# EAGLE design Adafruit DotStar Wing (EAGLE 6.4)
COMPANY: ADAFRUIT INDUSTRIES; DRAWN: KTOWN; REV: A
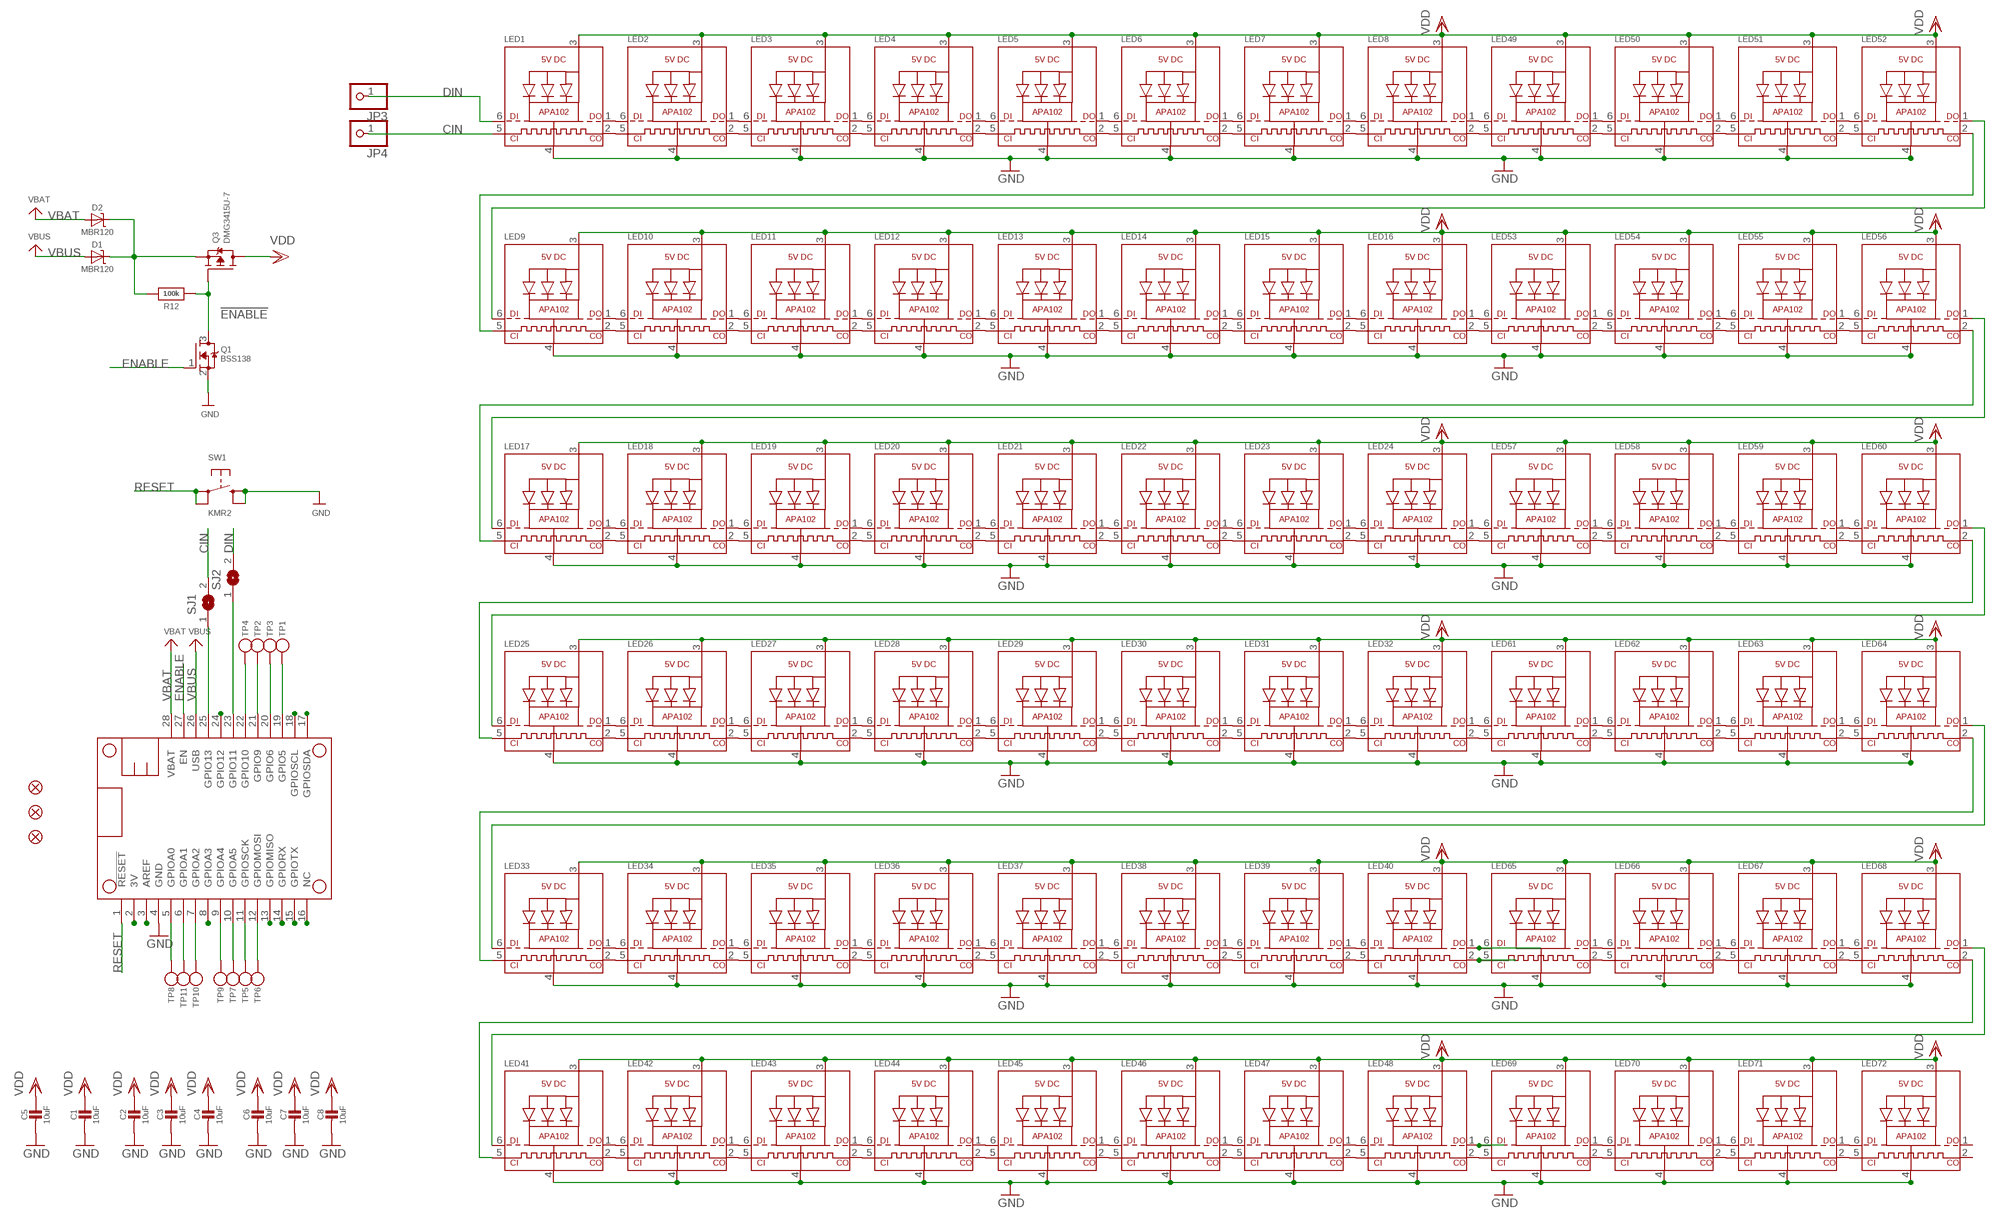
[diagram p0: schematic, sheet 1]

## Parts
C1  10uF  CAP_CERAMIC0805-NOOUTLINE  [0805-NO]
C2  10uF  CAP_CERAMIC0805-NOOUTLINE  [0805-NO]
C3  10uF  CAP_CERAMIC0805-NOOUTLINE  [0805-NO]
C4  10uF  CAP_CERAMIC0805-NOOUTLINE  [0805-NO]
C5  10uF  CAP_CERAMIC0805-NOOUTLINE  [0805-NO]
C6  10uF  CAP_CERAMIC0805-NOOUTLINE  [0805-NO]
C7  10uF  CAP_CERAMIC0805-NOOUTLINE  [0805-NO]
C8  10uF  CAP_CERAMIC0805-NOOUTLINE  [0805-NO]
D1  MBR120  DIODE-SCHOTTKYSOD-123  [SOD-123]
D2  MBR120  DIODE-SCHOTTKYSOD-123  [SOD-123]
FID1  FIDUCIAL_1MM  [FIDUCIAL_1MM]
FID2  FIDUCIAL_1MM  [FIDUCIAL_1MM]
FID3  FIDUCIAL_1MM  [FIDUCIAL_1MM]
JP3  HEADER-1X1ROUND  [1X01_ROUND]
JP4  HEADER-1X1ROUND  [1X01_ROUND]
LED1  APA1022020  [APA102_2020]
LED2  APA1022020  [APA102_2020]
LED3  APA1022020  [APA102_2020]
LED4  APA1022020  [APA102_2020]
LED5  APA1022020  [APA102_2020]
LED6  APA1022020  [APA102_2020]
LED7  APA1022020  [APA102_2020]
LED8  APA1022020  [APA102_2020]
LED9  APA1022020  [APA102_2020]
LED10  APA1022020  [APA102_2020]
LED11  APA1022020  [APA102_2020]
LED12  APA1022020  [APA102_2020]
LED13  APA1022020  [APA102_2020]
LED14  APA1022020  [APA102_2020]
LED15  APA1022020  [APA102_2020]
LED16  APA1022020  [APA102_2020]
LED17  APA1022020  [APA102_2020]
LED18  APA1022020  [APA102_2020]
LED19  APA1022020  [APA102_2020]
LED20  APA1022020  [APA102_2020]
LED21  APA1022020  [APA102_2020]
LED22  APA1022020  [APA102_2020]
LED23  APA1022020  [APA102_2020]
LED24  APA1022020  [APA102_2020]
LED25  APA1022020  [APA102_2020]
LED26  APA1022020  [APA102_2020]
LED27  APA1022020  [APA102_2020]
LED28  APA1022020  [APA102_2020]
LED29  APA1022020  [APA102_2020]
LED30  APA1022020  [APA102_2020]
LED31  APA1022020  [APA102_2020]
LED32  APA1022020  [APA102_2020]
LED33  APA1022020  [APA102_2020]
LED34  APA1022020  [APA102_2020]
LED35  APA1022020  [APA102_2020]
LED36  APA1022020  [APA102_2020]
LED37  APA1022020  [APA102_2020]
LED38  APA1022020  [APA102_2020]
LED39  APA1022020  [APA102_2020]
LED40  APA1022020  [APA102_2020]
LED41  APA1022020  [APA102_2020]
LED42  APA1022020  [APA102_2020]
LED43  APA1022020  [APA102_2020]
LED44  APA1022020  [APA102_2020]
LED45  APA1022020  [APA102_2020]
LED46  APA1022020  [APA102_2020]
LED47  APA1022020  [APA102_2020]
LED48  APA1022020  [APA102_2020]
LED49  APA1022020  [APA102_2020]
LED50  APA1022020  [APA102_2020]
LED51  APA1022020  [APA102_2020]
LED52  APA1022020  [APA102_2020]
LED53  APA1022020  [APA102_2020]
LED54  APA1022020  [APA102_2020]
LED55  APA1022020  [APA102_2020]
LED56  APA1022020  [APA102_2020]
LED57  APA1022020  [APA102_2020]
LED58  APA1022020  [APA102_2020]
LED59  APA1022020  [APA102_2020]
LED60  APA1022020  [APA102_2020]
LED61  APA1022020  [APA102_2020]
LED62  APA1022020  [APA102_2020]
LED63  APA1022020  [APA102_2020]
LED64  APA1022020  [APA102_2020]
LED65  APA1022020  [APA102_2020]
LED66  APA1022020  [APA102_2020]
LED67  APA1022020  [APA102_2020]
LED68  APA1022020  [APA102_2020]
LED69  APA1022020  [APA102_2020]
LED70  APA1022020  [APA102_2020]
LED71  APA1022020  [APA102_2020]
LED72  APA1022020  [APA102_2020]
MS1  FEATHERWING  [FEATHERWING]
Q1  BSS138  MOSFET-NWIDE  [SOT23-WIDE]
Q3  DMG3415U-7  MOSFET-PWIDE  [SOT23-WIDE]
R12  100k  RESISTOR_0603_NOOUT  [0603-NO]
SJ1  SOLDERJUMPERCLOSED  [SOLDERJUMPER_CLOSEDWIRE]
SJ2  SOLDERJUMPERCLOSED  [SOLDERJUMPER_CLOSEDWIRE]
SW1  KMR2  SWITCH_TACT_SMT4.6X2.8  [BTN_KMR2_4.6X2.8]
TP1  TESTPOINT1.5X2.0MM_NOCREAM  [PAD-1.5X2.0]
TP2  TESTPOINT1.5X2.0MM_NOCREAM  [PAD-1.5X2.0]
TP3  TESTPOINT1.5X2.0MM_NOCREAM  [PAD-1.5X2.0]
TP4  TESTPOINT1.5X2.0MM_NOCREAM  [PAD-1.5X2.0]
TP5  TESTPOINT1.5X2.0MM_NOCREAM  [PAD-1.5X2.0]
TP6  TESTPOINT1.5X2.0MM_NOCREAM  [PAD-1.5X2.0]
TP7  TESTPOINT1.5X2.0MM_NOCREAM  [PAD-1.5X2.0]
TP8  TESTPOINT1.5X2.0MM_NOCREAM  [PAD-1.5X2.0]
TP9  TESTPOINT1.5X2.0MM_NOCREAM  [PAD-1.5X2.0]
TP10  TESTPOINT1.5X2.0MM_NOCREAM  [PAD-1.5X2.0]
TP11  TESTPOINT1.5X2.0MM_NOCREAM  [PAD-1.5X2.0]

## Nets
3V: MS1.2(3V)
!ENABLE: Q1.3(D) Q3.1(G) R12.1
A0: MS1.5(GPIOA0) TP8.P$1
A1: MS1.6(GPIOA1) TP11.P$1
A2: MS1.7(GPIOA2) TP10.P$1
A3: MS1.8(GPIOA3)
A4: MS1.9(GPIOA4) TP9.P$1
A5: MS1.10(GPIOA5) TP7.P$1
AREF: MS1.3(AREF)
CIN: JP4.1 LED1.5(CKI) SJ1.2
DIN: JP3.1 LED1.6(DI) SJ2.2
ENABLE: MS1.27(EN) Q1.1(G)
G: MS1.16(NC)
GND: C1.2 C2.2 C3.2 C4.2 C5.2 C6.2 C7.2 C8.2 LED1.4(GND) LED2.4(GND) LED3.4(GND) LED4.4(GND) LED5.4(GND) LED6.4(GND) LED7.4(GND) LED8.4(GND) LED9.4(GND) LED10.4(GND) LED11.4(GND) LED12.4(GND) LED13.4(GND) LED14.4(GND) LED15.4(GND) LED16.4(GND) LED17.4(GND) LED18.4(GND) LED19.4(GND) LED20.4(GND) LED21.4(GND) LED22.4(GND) LED23.4(GND) LED24.4(GND) LED25.4(GND) LED26.4(GND) LED27.4(GND) LED28.4(GND) LED29.4(GND) LED30.4(GND) LED31.4(GND) LED32.4(GND) LED33.4(GND) LED34.4(GND) LED35.4(GND) LED36.4(GND) LED37.4(GND) LED38.4(GND) LED39.4(GND) LED40.4(GND) LED41.4(GND) LED42.4(GND) LED43.4(GND) LED44.4(GND) LED45.4(GND) LED46.4(GND) LED47.4(GND) LED48.4(GND) LED49.4(GND) LED50.4(GND) LED51.4(GND) LED52.4(GND) LED53.4(GND) LED54.4(GND) LED55.4(GND) LED56.4(GND) LED57.4(GND) LED58.4(GND) LED59.4(GND) LED60.4(GND) LED61.4(GND) LED62.4(GND) LED63.4(GND) LED64.4(GND) LED65.4(GND) LED66.4(GND) LED67.4(GND) LED68.4(GND) LED69.4(GND) LED70.4(GND) LED71.4(GND) LED72.4(GND) MS1.4(GND) Q1.2(S) SW1.B'(S1) SW1.B(S)
H: MS1.19(GPIO5) TP1.P$1
I: MS1.20(GPIO6) TP3.P$1
J: MS1.21(GPIO9) TP2.P$1
K: MS1.22(GPIO10) TP4.P$1
L: MS1.23(GPIO11) SJ2.1
M: MS1.24(GPIO12)
MISO: MS1.13(GPIOMISO)
MOSI: MS1.12(GPIOMOSI) TP6.P$1
N: MS1.25(GPIO13) SJ1.1
N$1: LED1.1(DO) LED2.6(DI)
N$2: LED1.2(CKO) LED2.5(CKI)
N$3: LED2.1(DO) LED3.6(DI)
N$4: LED2.2(CKO) LED3.5(CKI)
N$5: LED3.1(DO) LED4.6(DI)
N$6: LED3.2(CKO) LED4.5(CKI)
N$7: LED4.1(DO) LED5.6(DI)
N$8: LED4.2(CKO) LED5.5(CKI)
N$9: LED5.1(DO) LED6.6(DI)
N$10: LED5.2(CKO) LED6.5(CKI)
N$11: LED6.1(DO) LED7.6(DI)
N$12: LED6.2(CKO) LED7.5(CKI)
N$13: LED7.1(DO) LED8.6(DI)
N$14: LED7.2(CKO) LED8.5(CKI)
N$15: LED9.1(DO) LED10.6(DI)
N$16: LED9.2(CKO) LED10.5(CKI)
N$17: LED10.1(DO) LED11.6(DI)
N$18: LED10.2(CKO) LED11.5(CKI)
N$19: LED11.1(DO) LED12.6(DI)
N$20: LED11.2(CKO) LED12.5(CKI)
N$21: LED12.1(DO) LED13.6(DI)
N$22: LED12.2(CKO) LED13.5(CKI)
N$23: LED13.1(DO) LED14.6(DI)
N$24: LED13.2(CKO) LED14.5(CKI)
N$25: LED14.1(DO) LED15.6(DI)
N$26: LED14.2(CKO) LED15.5(CKI)
N$27: LED15.1(DO) LED16.6(DI)
N$28: LED15.2(CKO) LED16.5(CKI)
N$29: LED17.1(DO) LED18.6(DI)
N$30: LED17.2(CKO) LED18.5(CKI)
N$31: LED18.1(DO) LED19.6(DI)
N$32: LED18.2(CKO) LED19.5(CKI)
N$33: LED19.1(DO) LED20.6(DI)
N$34: LED19.2(CKO) LED20.5(CKI)
N$35: LED20.1(DO) LED21.6(DI)
N$36: LED20.2(CKO) LED21.5(CKI)
N$37: LED21.1(DO) LED22.6(DI)
N$38: LED21.2(CKO) LED22.5(CKI)
N$39: LED22.1(DO) LED23.6(DI)
N$40: LED22.2(CKO) LED23.5(CKI)
N$41: LED23.1(DO) LED24.6(DI)
N$42: LED23.2(CKO) LED24.5(CKI)
N$43: LED25.1(DO) LED26.6(DI)
N$44: LED25.2(CKO) LED26.5(CKI)
N$45: LED26.1(DO) LED27.6(DI)
N$46: LED26.2(CKO) LED27.5(CKI)
N$47: LED27.1(DO) LED28.6(DI)
N$48: LED27.2(CKO) LED28.5(CKI)
N$49: LED28.1(DO) LED29.6(DI)
N$50: LED28.2(CKO) LED29.5(CKI)
N$51: LED29.1(DO) LED30.6(DI)
N$52: LED29.2(CKO) LED30.5(CKI)
N$53: LED30.1(DO) LED31.6(DI)
N$54: LED30.2(CKO) LED31.5(CKI)
N$55: LED31.1(DO) LED32.6(DI)
N$56: LED31.2(CKO) LED32.5(CKI)
N$57: LED33.1(DO) LED34.6(DI)
N$58: LED33.2(CKO) LED34.5(CKI)
N$59: LED34.1(DO) LED35.6(DI)
N$60: LED34.2(CKO) LED35.5(CKI)
N$61: LED35.1(DO) LED36.6(DI)
N$62: LED35.2(CKO) LED36.5(CKI)
N$63: LED36.1(DO) LED37.6(DI)
N$64: LED36.2(CKO) LED37.5(CKI)
N$65: LED37.1(DO) LED38.6(DI)
N$66: LED37.2(CKO) LED38.5(CKI)
N$67: LED38.1(DO) LED39.6(DI)
N$68: LED38.2(CKO) LED39.5(CKI)
N$69: LED39.1(DO) LED40.6(DI)
N$70: LED39.2(CKO) LED40.5(CKI)
N$71: LED41.1(DO) LED42.6(DI)
N$72: LED41.2(CKO) LED42.5(CKI)
N$73: LED42.1(DO) LED43.6(DI)
N$74: LED42.2(CKO) LED43.5(CKI)
N$75: LED43.1(DO) LED44.6(DI)
N$76: LED43.2(CKO) LED44.5(CKI)
N$77: LED44.1(DO) LED45.6(DI)
N$78: LED44.2(CKO) LED45.5(CKI)
N$79: LED45.1(DO) LED46.6(DI)
N$80: LED45.2(CKO) LED46.5(CKI)
N$81: LED46.1(DO) LED47.6(DI)
N$82: LED46.2(CKO) LED47.5(CKI)
N$83: LED47.1(DO) LED48.6(DI)
N$84: LED47.2(CKO) LED48.5(CKI)
N$85: LED8.1(DO) LED49.6(DI)
N$86: LED8.2(CKO) LED49.5(CKI)
N$87: LED49.1(DO) LED50.6(DI)
N$88: LED49.2(CKO) LED50.5(CKI)
N$89: LED50.1(DO) LED51.6(DI)
N$90: LED50.2(CKO) LED51.5(CKI)
N$91: LED51.1(DO) LED52.6(DI)
N$92: LED51.2(CKO) LED52.5(CKI)
N$93: LED16.1(DO) LED53.6(DI)
N$94: LED16.2(CKO) LED53.5(CKI)
N$95: LED53.1(DO) LED54.6(DI)
N$96: LED53.2(CKO) LED54.5(CKI)
N$97: LED54.1(DO) LED55.6(DI)
N$98: LED54.2(CKO) LED55.5(CKI)
N$99: LED55.1(DO) LED56.6(DI)
N$100: LED55.2(CKO) LED56.5(CKI)
N$101: LED24.1(DO) LED57.6(DI)
N$102: LED24.2(CKO) LED57.5(CKI)
N$103: LED57.1(DO) LED58.6(DI)
N$104: LED57.2(CKO) LED58.5(CKI)
N$105: LED58.1(DO) LED59.6(DI)
N$106: LED58.2(CKO) LED59.5(CKI)
N$107: LED59.1(DO) LED60.6(DI)
N$108: LED59.2(CKO) LED60.5(CKI)
N$109: LED61.1(DO) LED62.6(DI)
N$110: LED61.2(CKO) LED62.5(CKI)
N$111: LED62.1(DO) LED63.6(DI)
N$112: LED62.2(CKO) LED63.5(CKI)
N$114: LED9.5(CKI) LED52.2(CKO)
N$115: LED17.6(DI) LED56.1(DO)
N$116: LED17.5(CKI) LED56.2(CKO)
N$118: LED25.5(CKI) LED60.2(CKO)
N$119: LED33.6(DI) LED64.1(DO)
N$121: LED63.1(DO) LED64.6(DI)
N$122: LED63.2(CKO) LED64.5(CKI)
N$123: LED65.1(DO) LED66.6(DI)
N$124: LED48.1(DO) LED69.6(DI)
N$125: LED41.5(CKI) LED68.2(CKO)
N$126: LED41.6(DI) LED68.1(DO)
N$127: LED65.2(CKO) LED66.5(CKI)
N$128: LED66.1(DO) LED67.6(DI)
N$129: LED66.2(CKO) LED67.5(CKI)
N$130: LED67.1(DO) LED68.6(DI)
N$131: LED67.2(CKO) LED68.5(CKI)
N$132: LED69.1(DO) LED70.6(DI)
N$133: LED69.2(CKO) LED70.5(CKI)
N$134: LED70.1(DO) LED71.6(DI)
N$135: LED70.2(CKO) LED71.5(CKI)
N$136: LED71.1(DO) LED72.6(DI)
N$137: LED71.2(CKO) LED72.5(CKI)
N$138: LED9.6(DI) LED52.1(DO)
N$139: D1.C D2.C Q3.2(S) R12.2
N$140: LED32.2(CKO) LED61.5(CKI)
N$141: LED32.1(DO) LED61.6(DI)
N$142: LED25.6(DI) LED60.1(DO)
N$145: LED33.5(CKI) LED64.2(CKO)
N$149: LED48.2(CKO) LED69.5(CKI)
N$150: LED40.2(CKO) LED65.5(CKI)
N$151: LED40.1(DO) LED65.6(DI)
RESET: MS1.1(!RESET) SW1.A'(P1) SW1.A(P)
RX: MS1.14(GPIORX)
SCK: MS1.11(GPIOSCK) TP5.P$1
SCL: MS1.18(GPIOSCL)
SDA: MS1.17(GPIOSDA)
TX: MS1.15(GPIOTX)
VBAT: D2.A MS1.28(VBAT)
VBUS: D1.A MS1.26(USB)
VDD: C1.1 C2.1 C3.1 C4.1 C5.1 C6.1 C7.1 C8.1 LED1.3(VDD) LED2.3(VDD) LED3.3(VDD) LED4.3(VDD) LED5.3(VDD) LED6.3(VDD) LED7.3(VDD) LED8.3(VDD) LED9.3(VDD) LED10.3(VDD) LED11.3(VDD) LED12.3(VDD) LED13.3(VDD) LED14.3(VDD) LED15.3(VDD) LED16.3(VDD) LED17.3(VDD) LED18.3(VDD) LED19.3(VDD) LED20.3(VDD) LED21.3(VDD) LED22.3(VDD) LED23.3(VDD) LED24.3(VDD) LED25.3(VDD) LED26.3(VDD) LED27.3(VDD) LED28.3(VDD) LED29.3(VDD) LED30.3(VDD) LED31.3(VDD) LED32.3(VDD) LED33.3(VDD) LED34.3(VDD) LED35.3(VDD) LED36.3(VDD) LED37.3(VDD) LED38.3(VDD) LED39.3(VDD) LED40.3(VDD) LED41.3(VDD) LED42.3(VDD) LED43.3(VDD) LED44.3(VDD) LED45.3(VDD) LED46.3(VDD) LED47.3(VDD) LED48.3(VDD) LED49.3(VDD) LED50.3(VDD) LED51.3(VDD) LED52.3(VDD) LED53.3(VDD) LED54.3(VDD) LED55.3(VDD) LED56.3(VDD) LED57.3(VDD) LED58.3(VDD) LED59.3(VDD) LED60.3(VDD) LED61.3(VDD) LED62.3(VDD) LED63.3(VDD) LED64.3(VDD) LED65.3(VDD) LED66.3(VDD) LED67.3(VDD) LED68.3(VDD) LED69.3(VDD) LED70.3(VDD) LED71.3(VDD) LED72.3(VDD) Q3.3(D)
Unconnected: LED72.1(DO) LED72.2(CKO)

## Library data of the parts
C1-C8 = microbuilder:CAP_CERAMIC: Ceramic Capacitors For new designs, use the packages preceded by an '_' character since they are more reliable: The following footprints should be used on most boards: _0402 - Standard footprint for regular board layouts _0603 - Standard footprint for regular board layouts _0805 - Standard footprint for regular board layouts _1206 - Standard footprint for regular board layouts For extremely tight-pitch boards where space is at a premium, the following 'micro-pitch' footprints can be used (smaller pads, no silkscreen outline, etc.): _0402MP - Micro-pitch footprint for very dense/compact boards _0603MP - Micro-pitch footprint for very dense/compact boards _0805MP - Micro-pitch footprint for very dense/compact boards _1206MP - Micro-pitch footprint for very dense/compact boards
D1 D2 = microbuilder:DIODE-SCHOTTKY
FID1-FID3 = microbuilder:FIDUCIAL: Fiducial Alignment Points Various fiducial points for machine vision alignment.; BOM: EXCLUDE
JP3 JP4 = microbuilder:HEADER-1X1: PIN HEADER
LED1-LED72 = microbuilder:APA102: APA102/DotStar Pixels VCC: 5V DC Refresh Rate: 400Hz
MS1 = microbuilder:FEATHERWING
Q1 = microbuilder:MOSFET-N: N-Channel Mosfet LEGEND VDS: Voltage Drain-Source ID: Drain Current RDS(ON): Drain-Source On-State Resistance VGS(TH): Gate-Source Threshold Voltage CISS: Drain-Source Input Capacitance SOT-23 Name VDS ID RDS(ON) VGS(TH) CISS Order Number 2N7002E 60V 260mA 2.5 Ohm 2.5V @ 250uA 26.7pF @ 25V 2N7002ET1GOSTR-ND BSH103 30V 850mA 400 mOhm 400mV @ 1mA 83pF @ 24V BSH103,235-ND BSS138 60V 320mA 1.6 Ohm 1.5V @ 250uA 50pF @ 10V Mouser: 771-BSS138PW115 DMN2075U-7 20V 4.2A 38 mOhm 1V @ 250 uA 594.3pF @ 10V DMN2075U-7DICT-ND * BSS138 good choice for I2C level-shifting POWERPAK 1212-8 Name VDS ID RDS(ON) VGS(TH) CISS Order Number Si7308DN 60V 6A 58 mOhm 3V @ 250uA 665pF @ 15V SI7308DN-T1-E3CT-ND
Q3 = microbuilder:MOSFET-P: P-Channel Mosfet LEGEND VDS: Voltage Drain-Source ID: Drain Current RDS(ON): Drain-Source On-State Resistance VGS(TH): Gate-Source Threshold Voltage CISS: Drain-Source Input Capacitance SOT-23 Name VDS ID RDS(ON) VGS(TH) CISS Order Number IRLML5103 30V 760mA 600 mOhm -- 75pF @ 25V Digikey: IRLML5103PBFCT-ND IRLML6401 12V 4.3A 50 mOhm 950mV @ 250µA 830pF @ 10V Digikey: IRLML6401PBFTR-ND NTR0202PL 20V 400mA 800 mOhm 2.3V @ 250uA 70pF @ 5V Digikey: NTR0202PLT1GOSTR-ND NTR4101PT1G 20V 1.8A 85 mOhm 1.2V @ 250uA 675pF @ 10V Digikey: NTR4101PT1GOSCT-ND DMP2004K 20V 600mA 900 mOhm 1V @ 250uA 175pF @ 16V Digikey: DMP2004KDICT-ND PMV65XP 20V 3.9A 76 mOhm 950mV @ 1mA 725pF @ 20V Digikey: 568-2358-2-ND TO-252 Name VDS ID RDS(ON) VGS(TH) CISS Order Number AOD417 30V 25A 34 mOhm 3V @ 250µA 920pF @ 15V Digikey: 785-1106-2-ND
R12 = microbuilder:RESISTOR: Resistors For new designs, use the packages preceded by an '_' character since they are more reliable: The following footprints should be used on most boards: _0402 - Standard footprint for regular board layouts _0603 - Standard footprint for regular board layouts _0805 - Standard footprint for regular board layouts _1206 - Standard footprint for regular board layouts For extremely tight-pitch boards where space is at a premium, the following 'micro-pitch' footprints can be used (smaller pads, no silkscreen outline, etc.): _0402MP - Micro-pitch footprint for very dense/compact boards _0603MP - Micro-pitch footprint for very dense/compact boards _0805MP - Micro-pitch footprint for very dense/compact boards _1206MP - Micro-pitch footprint for very dense/compact boards
SJ1 SJ2 = microbuilder:SOLDERJUMPER: SMD Solder JUMPER Solder the two pads together to create a connection, or remove the solder to break it. REFLOW - Use this footprint for solder paste and reflow ovens. WAVE - Use this footprint for hand-soldering (larger pads). CLOSED - Has a trace between the two pads to ensure it is closed by default. The trace needs to be cut to disable the jumper, and can be closed again by creating a solder bridge between the two pads.
SW1 = microbuilder:SWITCH_TACT_SMT: SMT Tact Switches 6x6mm - Digikey: P12940SCT-ND KMR2 (4.6x2.8mm) - Digikey: 401-1426-1-ND EVQ-PQHB55 - Light Touch, 160GF (4.5x4.5mm) - Digikey: P8090SCT-ND KMT0 - KMT021 NGJ LHS (etc.) IP68/Waterproof - Digikey: CKN10289CT-ND
TP1-TP11 = microbuilder:TESTPOINT: Test Point Various test points for characterisation and PCB testing TESTPOINT_SMT - Compact Surface Mount Test Point [Digikey: 5016KTR-ND]

## Board
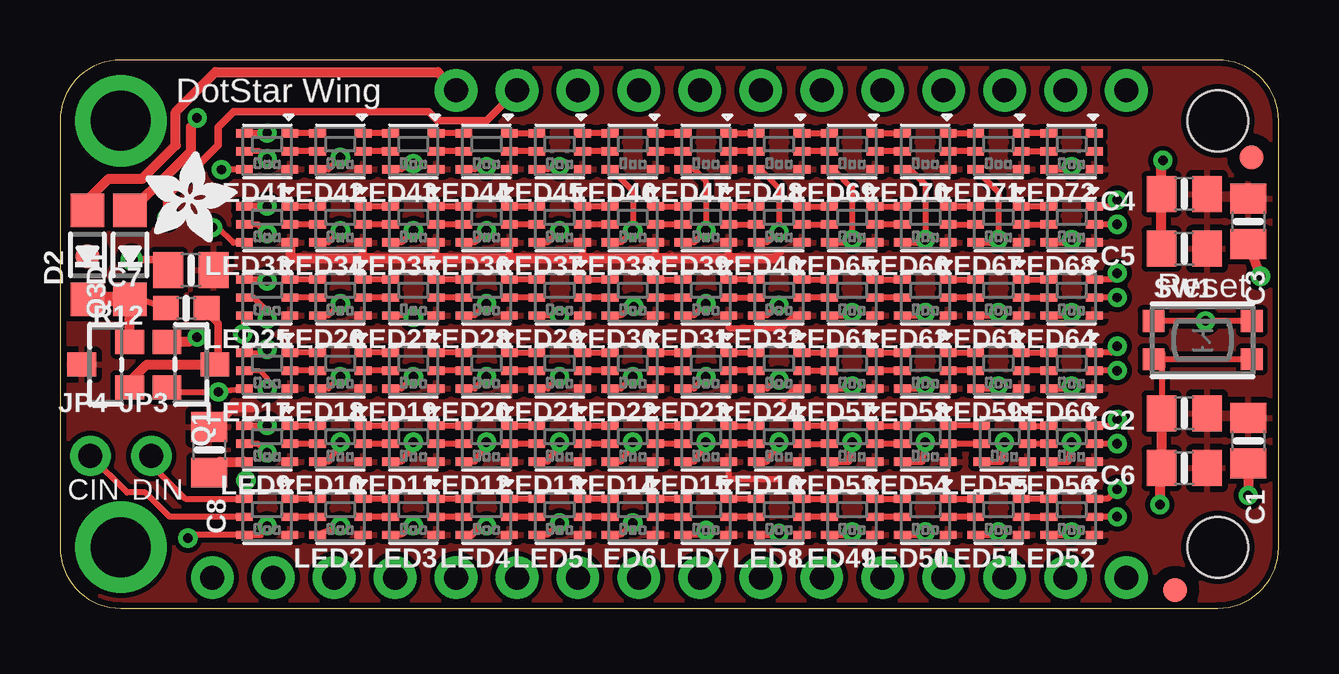
[diagram p1: board, top side]
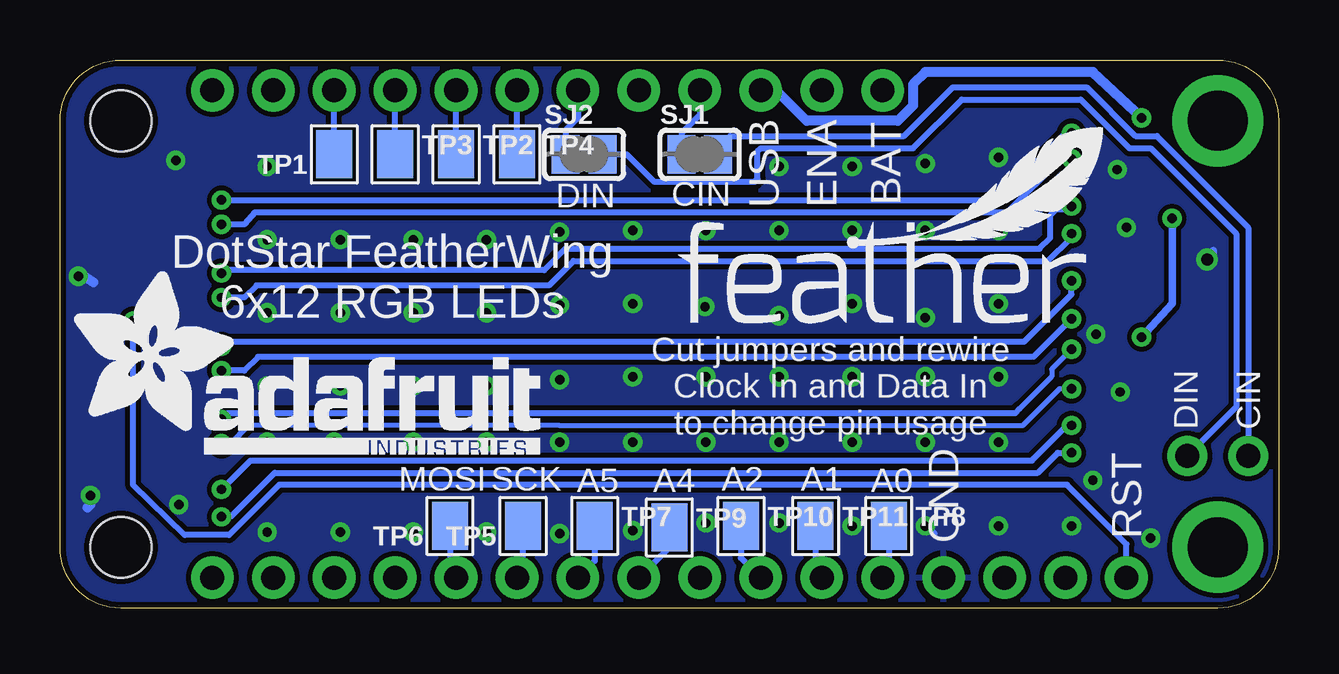
[diagram p2: board, bottom side, seen from below]

Size 50.8 x 22.86 mm. Coordinates in mm from the lower left corner, seen from the top.
Copper layers (1*16): Top 0.035mm / dielectric 1.5mm / Bottom 0.035mm
Design rules "adafruit 7-7": minimum track width 6mil, minimum drill 15.5mil, track to track 8mil, track to pad 7mil, pad to pad 7mil, via to via 7mil, smd to smd 7mil, copper to edge 10mil, drill to drill 8mil, minimum pad ring 10mil, minimum via ring 8mil, stop-mask expansion 2mil, vias tented up to drill 20mil, thermal gap 10mil

### Footprints (pad centres in the part's own frame; a part is rotated, then mirrored left to right if it is on the bottom)
0805-NO = smd 1.24 x 1.5: 1 -0.95,0; 2 0.95,0
SOD-123 = smd 1.4 x 1.4: A 1.85,0; C -1.85,0
FIDUCIAL_1MM = smd 1 x 1: 1 0,0
1X01_ROUND = drill 1 pad 1.676: 1 0,0
APA102_2020 = smd 0.7 x 0.35: 1 -0.95,-0.75; 2 -0.95,0; 3 -0.95,0.75; 4 0.95,0.75; 5 0.95,0; 6 0.95,-0.75
FEATHERWING = drill 1 pad 1.778: 1 6.35,1.27; 2 8.89,1.27; 3 11.43,1.27; 4 13.97,1.27; 5 16.51,1.27; 6 19.05,1.27; 7 21.59,1.27; 8 24.13,1.27; 9 26.67,1.27; 10 29.21,1.27; 11 31.75,1.27; 12 34.29,1.27; 13 36.83,1.27; 14 39.37,1.27; 15 41.91,1.27; 16 44.45,1.27; 17 44.45,21.59; 18 41.91,21.59; 19 39.37,21.59; 20 36.83,21.59; 21 34.29,21.59; 22 31.75,21.59; 23 29.21,21.59; 24 26.67,21.59; 25 24.13,21.59; 26 21.59,21.59; 27 19.05,21.59; 28 16.51,21.59 | drill 2.5 pad 3.81: P$1 2.54,20.32; P$2 2.54,2.54 | hole 2.54: 48.26,20.32; 48.26,2.54
SOT23-WIDE = smd 1 x 1.2: 1 -0.95,-1; 2 0.95,-1; 3 0,1
0603-NO = smd 1.075 x 1: 1 -0.85,0; 2 0.85,0
SOLDERJUMPER_CLOSEDWIRE = smd 1.168 x 1.6: 1 -0.762,0; 2 0.762,0 | smd 0.635 x 0.203: WIRE 0,0
BTN_KMR2_4.6X2.8 = smd 0.9 x 0.9: A 2.05,0.8; A' -2.05,0.8; B 2.05,-0.8; B' -2.05,-0.8
PAD-1.5X2.0 = smd 1.5 x 2: P$1 0,0

### Placement (x,y rotation side)
C1  49.53,6.99 270 top
C2  46.86,8.13 180 top
C3  49.53,16.13 270 top
C4  46.86,17.27 180 top
C5  46.86,14.99 180 top
C6  46.86,5.84 180 top
C7  5.46,14.1 180 top
C8  6.22,6.6 270 top
D1  2.92,14.73 90 top
D2  1.14,14.73 90 top
FID1  46.48,0.76 0 top
FID2  1.14,14.67 0 top
FID3  49.66,18.8 0 top
JP3  3.81,6.35 0 top
JP4  1.27,6.35 0 top
LED1  8.64,3.81 180 top
LED2  11.68,3.81 180 top
LED3  14.73,3.81 180 top
LED4  17.78,3.81 180 top
LED5  20.83,3.81 180 top
LED6  23.88,3.81 180 top
LED7  26.92,3.81 180 top
LED8  29.97,3.81 180 top
LED9  8.64,6.86 180 top
LED10  11.68,6.86 180 top
LED11  14.73,6.86 180 top
LED12  17.78,6.86 180 top
LED13  20.83,6.86 180 top
LED14  23.88,6.86 180 top
LED15  26.92,6.86 180 top
LED16  29.97,6.86 180 top
LED17  8.64,9.91 180 top
LED18  11.68,9.91 180 top
LED19  14.73,9.91 180 top
LED20  17.78,9.91 180 top
LED21  20.83,9.91 180 top
LED22  23.88,9.91 180 top
LED23  26.92,9.91 180 top
LED24  29.97,9.91 180 top
LED25  8.64,12.95 180 top
LED26  11.68,12.95 180 top
LED27  14.73,12.95 180 top
LED28  17.78,12.95 180 top
LED29  20.83,12.95 180 top
LED30  23.88,12.95 180 top
LED31  26.92,12.95 180 top
LED32  29.97,12.95 180 top
LED33  8.64,16 180 top
LED34  11.68,16 180 top
LED35  14.73,16 180 top
LED36  17.78,16 180 top
LED37  20.83,16 180 top
LED38  23.88,16 180 top
LED39  26.92,16 180 top
LED40  29.97,16 180 top
LED41  8.64,19.05 180 top
LED42  11.68,19.05 180 top
LED43  14.73,19.05 180 top
LED44  17.78,19.05 180 top
LED45  20.83,19.05 180 top
LED46  23.88,19.05 180 top
LED47  26.92,19.05 180 top
LED48  29.97,19.05 180 top
LED49  33.02,3.81 180 top
LED50  36.07,3.81 180 top
LED51  39.12,3.81 180 top
LED52  42.16,3.81 180 top
LED53  33.02,6.86 180 top
LED54  36.07,6.86 180 top
LED55  39.37,6.86 180 top
LED56  42.16,6.86 180 top
LED57  33.02,9.91 180 top
LED58  36.07,9.91 180 top
LED59  39.12,9.91 180 top
LED60  42.16,9.91 180 top
LED61  33.02,12.95 180 top
LED62  36.07,12.95 180 top
LED63  39.12,12.95 180 top
LED64  42.16,12.95 180 top
LED65  33.02,16 180 top
LED66  36.07,16 180 top
LED67  39.12,16 180 top
LED68  42.16,16 180 top
LED69  33.02,19.05 180 top
LED70  36.07,19.05 180 top
LED71  39.12,19.05 180 top
LED72  42.16,19.05 180 top
MS1  0,0 0 top
Q1  5.46,10.16 270 top
Q3  1.91,10.16 90 top
R12  5.27,12.51 180 top
SJ1  24.13,18.92 0 bottom
SJ2  28.96,18.92 0 bottom
SW1  47.62,11.18 0 top
TP1  39.37,18.92 180 bottom
TP2  34.29,18.92 0 bottom
TP3  36.83,18.92 0 bottom
TP4  31.75,18.92 0 bottom
TP5  31.5,3.43 180 bottom
TP6  34.54,3.43 180 bottom
TP7  28.51,3.43 0 bottom
TP8  16.26,3.43 0 bottom
TP9  25.4,3.37 0 bottom
TP10  22.42,3.43 0 bottom
TP11  19.3,3.43 0 bottom
U$1  [ADAFRUIT_TEXT_20MM]  50.36,6.41 0 bottom
U$8  [FEATHERLOGO_MED]  25.15,11.81 0 bottom
U$9  [ADAFRUIT_3.5MM]  3.56,15.24 0 top

### Tracks (layer width: path | path; a pad name or v marks a point on that pad's centre or on a via)
!ENABLE
  Top 0.305: R12.1 6.12,12.36 6.6,11.87 6.6,10.3 Q1.3
  Top 0.406: Q3.1 2.9,9.45 3.62,10.16 Q1.3
A0
  Bottom 0.254: TP8.P$1 16.26,1.52 MS1.5
A1
  Bottom 0.254: TP11.P$1 19.3,1.52 MS1.6
A2
  Bottom 0.254: TP10.P$1 22.42,2.1 MS1.7
A4
  Bottom 0.254: TP9.P$1 25.4,2.54 MS1.9
A5
  Bottom 0.254: TP7.P$1 28.51,1.97 MS1.10
CIN
  Top 0.254: JP4.1 2.79,4.83 3.56,4.83 4.57,3.81 LED1.5
  Bottom 0.254: SJ1.2 22.86,19.68 15.62,19.68 13.59,21.72 8,21.72 5.97,19.68 5.08,19.68 1.27,15.88 JP4.1
DIN
  Top 0.254: JP3.1 3.81,5.97 5.22,4.56 LED1.6
  Bottom 0.254: SJ2.2 27.18,18.92 26.04,17.78 21.84,17.78 21.72,17.91 21.72,19.05 21.59,19.18 15.24,19.18 13.21,21.21 8.26,21.21 6.22,19.18 5.33,19.18 1.78,15.62 1.78,8.38 JP3.1
ENABLE  (via drill 0.39)
  Top 0.305: MS1.27 17.78,20.32 15.75,20.32 15.37,20.7 7.24,20.7 6.6,20.07 6.6,19.3 4.45,17.14 v4.45,16.26 | v5.71,11.3 5.46,11.19 5.38,11.11
  Top 0.406: 4.33,10.81 Q1.1 5.38,11.11
  Bottom 0.305: v4.45,16.26 4.45,12.7 v5.71,11.3
GND  (via drill 0.39, 0.5)
  Top 0.254: LED16.4 29.48,6.11 v29.97,6.92 | v29.97,9.53 29.48,9.16 LED24.4 | v26.92,9.65 26.43,9.16 LED23.4 | v23.88,9.65 23.38,9.16 LED22.4 | v23.88,6.92 23.38,6.11 LED14.4 | v26.92,6.92 26.43,6.11 LED15.4 | v20.83,6.92 20.33,6.11 LED13.4 | v20.83,9.65 20.33,9.16 LED21.4 | v29.97,12.64 29.48,12.2 LED32.4 | LED40.4 29.48,15.25 v29.97,15.68 29.97,17.53 29.2,18.3 LED48.4 | LED39.4 26.43,15.25 v26.92,15.75 26.92,17.8 26.43,18.3 LED47.4 | LED38.4 23.38,15.25 v23.88,15.75 23.88,17.4 22.98,18.3 LED46.4 | v26.92,12.7 26.43,12.2 LED31.4 | v23.91,12.57 23.38,12.2 LED30.4 | v20.83,12.19 20.33,12.2 LED29.4 | v17.78,12.7 17.28,12.2 LED28.4 | v17.78,9.65 17.28,9.16 LED20.4 | v14.73,9.65 14.24,9.16 LED19.4 | v14.73,12.12 14.24,12.2 LED27.4 | v20.83,15.75 20.33,15.25 LED37.4 | v17.78,15.75 17.28,15.25 LED36.4 | v14.73,15.75 14.24,15.25 LED35.4 | v11.68,9.65 11.19,9.16 LED18.4 | v11.68,6.92 11.19,6.11 LED10.4 | v14.73,6.92 14.24,6.11 LED11.4 | v17.78,6.92 17.28,6.11 LED12.4 | v11.68,12.7 11.19,12.2 LED26.4 | v11.68,15.75 11.19,15.25 LED34.4 | v20.83,18.41 20.33,18.3 LED45.4 | v17.78,18.41 17.28,18.3 LED44.4 | v14.73,18.54 14.24,18.3 LED43.4 | v11.68,18.8 11.19,18.3 LED42.4 | LED8.4 29.92,3.06 v29.97,3.11 | v26.92,3.24 26.68,3.06 LED7.4 | v23.88,3.56 23.38,3.06 LED6.4 | v20.83,3.56 20.33,3.06 LED5.4 | v17.78,3.43 17.53,3.43 | v14.73,3.43 14.24,3.06 LED3.4 | v11.68,3.43 11.38,3.31 LED2.4 | LED49.4 32.91,3.06 v33.02,3.17 | LED50.4 35.95,3.06 v36.07,3.17 | LED51.4 39,3.06 v39.12,3.17 | LED52.4 42.05,3.06 v42.16,3.17 | LED53.4 32.91,6.11 v33.02,6.92 | LED54.4 35.95,6.11 v36.07,6.92 | LED55.4 39.26,6.11 v39.37,6.92 | LED56.4 42.05,6.11 v42.16,6.92
  Top 0.254: LED60.4 42.05,9.16 v42.16,9.27 | LED59.4 39,9.16 v39.12,9.27 | LED58.4 35.95,9.16 v36.07,9.27 | LED57.4 32.91,9.16 v33.02,9.27 | LED61.4 32.91,12.2 v33.02,12.32 | LED62.4 35.95,12.2 v36.07,12.32 | LED63.4 39,12.2 v39.12,12.32 | LED64.4 42.05,12.2 v42.16,12.32 | LED65.4 32.91,15.25 v33.02,15.37 33.02,17.53 32.25,18.3 LED69.4 | LED66.4 35.95,15.25 v36.07,15.37 36.07,17.65 35.42,18.3 LED70.4 | LED67.4 39,15.25 v39.12,15.37 39.12,17.35 LED71.4 | LED68.4 42.05,15.25 v42.16,15.37 | LED72.4 42.05,18.3 v42.16,18.41 | v8.64,3.43 8.38,3.05 7.67,3.05 LED1.4 5.47,3.06 v5.33,2.92 | LED9.4 7.67,6.1 v7.75,5.33 | LED17.4 7.67,9.14 v6.6,9.02 4.53,9.02 Q1.2 | LED25.4 7.67,12.19 v7.62,11.43 | LED33.4 7.67,15.24 7.24,15.24 6.6,15.88 v6.35,15.88 | LED41.4 7.67,18.29 v6.73,18.29 | C2.2 45.96,10.62 SW1.B' SW1.B
  Top 0.305: LED4.4 17.16,3.06 17.53,3.43 | 4.51,14.48 C7.2 4.07,14.54 v2.98,14.54
  Top 0.406: v45.97,18.67 45.91,18.41 C4.2 C5.2 | C2.2 C6.2 45.85,5.78 v45.85,4.32 | C8.2 6.68,6.11 LED9.4 | C3.2 v50.04,13.84 | C1.2 v49.53,4.7
  Bottom 0.254: 14.35,3.11 v14.73,3.43 | v33.02,3.17 33.02,3.05 | v36.07,3.17 36.07,3.05 | v39.12,3.17 39.12,3.05 | v42.16,3.17 42.16,3.05 | v42.16,6.92 42.29,6.73 | v42.16,9.27 42.16,9.02 42.29,8.89 | v39.12,9.27 39.12,9.02 | v36.07,9.27 36.07,8.89 | v33.02,9.27 33.02,9.14 | v33.02,12.32 33.02,12.19 | v36.07,12.32 36.07,12.19 | v39.12,12.32 39.12,12.19 | v42.16,12.32 42.16,12.06 | v33.02,15.37 33.02,15.11 | v36.07,15.37 36.07,15.11 | v39.12,15.37 39.12,15.11 | v42.16,15.37 42.16,15.24 | v42.16,18.41 42.16,18.29 | v6.6,9.02 6.48,9.14 | v7.62,11.43 7.37,11.43 | v6.73,18.29 6.6,18.03 | v5.33,2.92 5.21,2.79
  Bottom 0.305: v2.98,14.54 2.73,14.8 2.73,14.92
  Bottom 0.406: v45.85,4.32 45.97,4.19 | v50.04,13.84 49.78,13.84 49.4,13.59 | v49.53,4.7 49.53,4.32 49.66,4.19
  pour Bottom: 0,0 0,22.86 50.8,22.86 50.8,0
H
  Bottom 0.254: TP1.P$1 MS1.19
I
  Bottom 0.254: TP3.P$1 MS1.20
J
  Bottom 0.254: TP2.P$1 MS1.21
K
  Bottom 0.254: TP4.P$1 MS1.22
L
  Bottom 0.254: MS1.23 29.21,20.45 29.72,19.94 SJ2.1
MOSI
  Bottom 0.254: TP6.P$1 34.54,1.52 MS1.12
N
  Bottom 0.254: MS1.25 24.13,20.57 24.89,19.81 SJ1.1
N$1
  Top 0.254: LED2.6 LED1.1
N$2
  Top 0.254: LED2.5 LED1.2
N$3
  Top 0.254: LED3.6 LED2.1
N$4
  Top 0.254: LED3.5 LED2.2
N$5
  Top 0.254: LED4.6 LED3.1
N$6
  Top 0.254: LED4.5 LED3.2
N$7
  Top 0.254: LED5.6 LED4.1
N$8
  Top 0.254: LED5.5 LED4.2
N$9
  Top 0.254: LED6.6 LED5.1
N$10
  Top 0.254: LED6.5 LED5.2
N$11
  Top 0.254: LED7.6 LED6.1
N$12
  Top 0.254: LED7.5 LED6.2
N$13
  Top 0.254: LED8.6 LED7.1
N$14
  Top 0.254: LED8.5 LED7.2
N$15
  Top 0.254: LED10.6 LED9.1
N$16
  Top 0.254: LED10.5 LED9.2
N$17
  Top 0.254: LED11.6 LED10.1
N$18
  Top 0.254: LED11.5 LED10.2
N$19
  Top 0.254: LED12.6 LED11.1
N$20
  Top 0.254: LED12.5 LED11.2
N$21
  Top 0.254: LED13.6 LED12.1
N$22
  Top 0.254: LED13.5 LED12.2
N$23
  Top 0.254: LED14.6 LED13.1
N$24
  Top 0.254: LED14.5 LED13.2
N$25
  Top 0.254: LED15.6 LED14.1
N$26
  Top 0.254: LED15.5 LED14.2
N$27
  Top 0.254: LED15.1 LED16.6
N$28
  Top 0.254: LED16.5 LED15.2
N$29
  Top 0.254: LED18.6 LED17.1
N$30
  Top 0.254: LED18.5 LED17.2
N$31
  Top 0.254: LED19.6 LED18.1
N$32
  Top 0.254: LED19.5 LED18.2
N$33
  Top 0.254: LED20.6 LED19.1
N$34
  Top 0.254: LED20.5 LED19.2
N$35
  Top 0.254: LED20.1 LED21.6
N$36
  Top 0.254: LED21.5 LED20.2
N$37
  Top 0.254: LED21.1 LED22.6
N$38
  Top 0.254: LED22.5 LED21.2
N$39
  Top 0.254: LED22.1 LED23.6
N$40
  Top 0.254: LED23.5 LED22.2
N$41
  Top 0.254: LED23.1 LED24.6
N$42
  Top 0.254: LED24.5 LED23.2
N$43
  Top 0.254: LED26.6 LED25.1
N$44
  Top 0.254: LED26.5 LED25.2
N$45
  Top 0.254: LED27.6 LED26.1
N$46
  Top 0.254: LED27.5 LED26.2
N$47
  Top 0.254: LED28.6 LED27.1
N$48
  Top 0.254: LED28.5 LED27.2
N$49
  Top 0.254: LED29.6 LED28.1
N$50
  Top 0.254: LED29.5 LED28.2
N$51
  Top 0.254: LED29.1 LED30.6
N$52
  Top 0.254: LED30.5 LED29.2
N$53
  Top 0.254: LED30.1 LED31.6
N$54
  Top 0.254: LED31.5 LED30.2
N$55
  Top 0.254: LED32.6 LED31.1
N$56
  Top 0.254: LED31.2 LED32.5
N$57
  Top 0.254: LED34.6 LED33.1
N$58
  Top 0.254: LED34.5 LED33.2
N$59
  Top 0.254: LED35.6 LED34.1
N$60
  Top 0.254: LED35.5 LED34.2
N$61
  Top 0.254: LED36.6 LED35.1
N$62
  Top 0.254: LED36.5 LED35.2
N$63
  Top 0.254: LED37.6 LED36.1
N$64
  Top 0.254: LED37.5 LED36.2
N$65
  Top 0.254: LED38.6 LED37.1
N$66
  Top 0.254: LED38.5 LED37.2
N$67
  Top 0.254: LED38.1 LED39.6
N$68
  Top 0.254: LED39.5 LED38.2
N$69
  Top 0.254: LED40.6 LED39.1
N$70
  Top 0.254: LED39.2 LED40.5
N$71
  Top 0.254: LED42.6 LED41.1
N$72
  Top 0.254: LED42.5 LED41.2
N$73
  Top 0.254: LED43.6 LED42.1
N$74
  Top 0.254: LED43.5 LED42.2
N$75
  Top 0.254: LED44.6 LED43.1
N$76
  Top 0.254: LED44.5 LED43.2
N$77
  Top 0.254: LED44.1 LED45.6
N$78
  Top 0.254: LED45.5 LED44.2
N$79
  Top 0.254: LED46.6 LED45.1
N$80
  Top 0.254: LED46.5 LED45.2
N$81
  Top 0.254: LED47.6 LED46.1
N$82
  Top 0.254: LED47.5 LED46.2
N$83
  Top 0.254: LED47.1 LED48.6
N$84
  Top 0.254: LED48.5 LED47.2
N$85
  Top 0.254: LED8.1 LED49.6
N$86
  Top 0.254: LED49.5 LED8.2
N$87
  Top 0.254: LED49.1 LED50.6
N$88
  Top 0.254: LED50.5 LED49.2
N$89
  Top 0.254: LED50.1 LED51.6
N$90
  Top 0.254: LED51.5 LED50.2
N$91
  Top 0.254: LED52.6 LED51.1
N$92
  Top 0.254: LED51.2 LED52.5
N$93
  Top 0.254: LED53.6 LED16.1
N$94
  Top 0.254: LED16.2 LED53.5
N$95
  Top 0.254: LED53.1 LED54.6
N$96
  Top 0.254: LED54.5 LED53.2
N$97
  Top 0.254: LED55.6 38.35,7.61 38.35,7.62 LED54.1
N$98
  Top 0.254: LED55.5 LED54.2
N$99
  Top 0.254: LED55.1 LED56.6
N$100
  Top 0.254: LED56.5 LED55.2
N$101
  Top 0.254: LED24.1 LED57.6
N$102
  Top 0.254: LED24.2 LED57.5
N$103
  Top 0.254: LED57.1 LED58.6
N$104
  Top 0.254: LED58.5 LED57.2
N$105
  Top 0.254: LED58.1 LED59.6
N$106
  Top 0.254: LED59.5 LED58.2
N$107
  Top 0.254: LED59.1 LED60.6
N$108
  Top 0.254: LED60.5 LED59.2
N$109
  Top 0.254: LED61.1 LED62.6
N$110
  Top 0.254: LED62.5 LED61.2
N$111
  Top 0.254: LED62.1 LED63.6
N$112
  Top 0.254: LED63.5 LED62.2
N$114  (via drill 0.39)
  Top 0.254: v8.64,6.48 8.26,6.86 LED9.5 | v44.07,3.81 LED52.2
  Bottom 0.254: v8.64,6.48 9.21,6.48 10.03,5.65 41.85,5.65 43.69,3.81 v44.07,3.81
N$115  (via drill 0.39)
  Top 0.203: LED17.6 8.5,10.66 v8.64,10.79
  Top 0.254: v44.07,7.87 43.8,7.61 LED56.1
  Bottom 0.203: 10.79,8.32 9.46,9.65 9.46,9.97 v8.64,10.79
  Bottom 0.254: 10.79,8.32 10.99,8.13 43.81,8.13 v44.07,7.87
N$116  (via drill 0.39)
  Top 0.203: LED17.5 8.32,9.91 8.64,9.59 v8.64,9.14
  Top 0.254: v44.07,6.86 LED56.2
  Bottom 0.203: v8.64,9.14 9.14,9.14 10.67,7.62 29.97,7.62 42.93,7.62
  Bottom 0.254: 42.93,7.62 43.69,6.86 v44.07,6.86
N$118  (via drill 0.39)
  Top 0.254: LED25.5 8.06,12.95 8.64,12.38 v8.64,12.06 | v44.07,9.91 LED60.2
  Bottom 0.254: v8.64,12.06 10.22,10.48 42.54,10.48 LED60.2 v44.07,9.91
N$119  (via drill 0.39)
  Top 0.254: v8.64,16.76 7.7,16.76 LED33.6 | v44.07,13.97 43.8,13.7 LED64.1
  Bottom 0.254: v8.64,16.76 8.76,16.64 9.27,16.64 9.53,16.38 9.53,15.44 9.97,14.99 29.72,14.99 30.61,14.1 44.07,14.1 v44.07,13.97
N$121
  Top 0.254: LED63.1 LED64.6
N$122
  Top 0.254: LED63.2 LED64.5
N$123
  Top 0.254: LED65.1 LED66.6
N$124
  Top 0.254: LED48.1 LED69.6
N$125  (via drill 0.39)
  Top 0.254: v8.64,18.73 8.32,19.05 LED41.5 | v44.07,16 LED68.2
  Bottom 0.254: v8.64,18.73 9.08,18.73 11.3,16.51 42.67,16.51 LED68.2 v44.07,16
N$126  (via drill 0.39)
  Top 0.254: v8.64,19.81 7.7,19.81 LED41.6 | v44.07,17.02 43.8,16.75 LED68.1
  Bottom 0.254: v44.07,17.02 11.56,17.02 10.03,18.67 8.89,19.81 v8.64,19.81
N$127
  Top 0.254: LED66.5 LED65.2
N$128
  Top 0.254: LED67.6 LED66.1
N$129
  Top 0.254: LED66.2 LED67.5
N$130
  Top 0.254: LED68.6 LED67.1
N$131
  Top 0.254: LED67.2 LED68.5
N$132
  Top 0.254: LED69.1 LED70.6
N$133
  Top 0.254: LED70.5 LED69.2
N$134
  Top 0.254: LED70.1 LED71.6
N$135
  Top 0.254: LED71.5 LED70.2
N$136
  Top 0.254: LED72.6 LED71.1
N$137
  Top 0.254: LED71.2 LED72.5
N$138  (via drill 0.39)
  Top 0.254: v8.64,7.62 8.75,7.61 LED9.6 | v44.07,4.95 43.68,4.56 LED52.1
  Bottom 0.254: 8.83,7.62 10.29,6.16 42.86,6.16 v44.07,4.95 | 8.83,7.62 8.89,7.62 | 8.83,7.62 v8.64,7.62
N$139
  Top 0.254: R12.2 3.27,12.88 D1.C
  Top 0.406: Q3.2 2.9,12.87 D1.C
  Top 0.61: D2.C D1.C
N$140
  Top 0.254: LED61.5 LED32.2
N$141
  Top 0.254: LED32.1 LED61.6
N$142  (via drill 0.39)
  Top 0.254: v8.64,13.65 8.59,13.7 LED25.6 | v44.07,10.92 43.8,10.66 LED60.1
  Bottom 0.254: v8.64,13.65 8.64,13.08 10.6,11.11 43.88,11.11 v44.07,10.92
N$145  (via drill 0.39)
  Top 0.254: v8.64,15.62 8.26,16 LED33.5 | v44.07,12.95 LED64.2
  Bottom 0.254: v8.64,15.62 8.64,15.43 9.61,14.48 29.4,14.48 30.42,13.46 42.61,13.46 LED64.2 v44.07,12.95
N$149
  Top 0.254: LED69.5 LED48.2
N$150
  Top 0.254: LED40.2 LED65.5
N$151
  Top 0.254: LED40.1 LED65.6
RESET  (via drill 0.39)
  Top 0.254: SW1.A v47.75,11.98 SW1.A'
  Bottom 0.254: MS1.1 6.35,2.67 8.83,5.14 41.66,5.14 43.75,3.05 45.59,3.05 47.75,5.14 v47.75,11.98
SCK
  Bottom 0.254: MS1.11 31.5,1.52 TP5.P$1
VBAT
  Top 0.406: D2.A 1.14,17.02 2.03,17.91 3.43,17.91 4.83,19.3 4.83,20.7 6.48,22.35 15.75,22.35 MS1.28
VBUS  (via drill 0.39)
  Top 0.406: D1.A 3.94,17.53 5.46,19.05 5.46,20.07 v5.71,20.45
  Bottom 0.406: v5.71,20.45 7.75,22.35 14.73,22.35 15.24,21.84 15.24,20.95 15.88,20.32 19.68,20.32 20.95,21.59 MS1.26
VDD
  Top 0.254: LED16.3 30.68,6.11 | LED24.3 30.62,9.16 30.16,8.7 | LED15.3 27.87,5.4 29.97,5.4 | LED32.3 30.62,12.2 30.1,11.68 27.87,11.68 LED31.3 | LED48.3 30.68,18.3
  Top 0.305: 29.78,14.61 30.03,14.86 | LED39.3 27.87,14.61 25.53,14.61 | LED38.3 24.83,14.61 24.89,14.61 | LED37.3 21.78,14.61 21.91,14.61 | LED36.3 18.73,14.61 18.67,14.61 | LED35.3 15.68,14.61 | LED34.3 12.63,14.61 12.51,14.61
  Top 0.406: LED33.3 9.59,14.61 12.51,14.61 15.68,14.61 18.67,14.61 21.91,14.61 24.89,14.61 25.53,14.61 29.78,14.61 | C8.1 6.41,7.55 7.24,8.38 8,8.38
  pour Top: 0,22.86 0,0 50.8,0 50.8,22.86

### Text on the board
tPlace: DotStar Wing | Reset | CIN | DIN
bPlace: BAT | ENA | USB | CIN | DIN | DotStar FeatherWing / 6x12 RGB LEDs | CIN | DIN | Cut jumpers and rewire / Clock In and Data In / to change pin usage | RST | GND | A0 | A1 | A2 | A4 | A5 | SCK | MOSI